# Altium schematic sheet Power.SchDoc
size A4; SheetNumber: 3; SheetTotal: 3
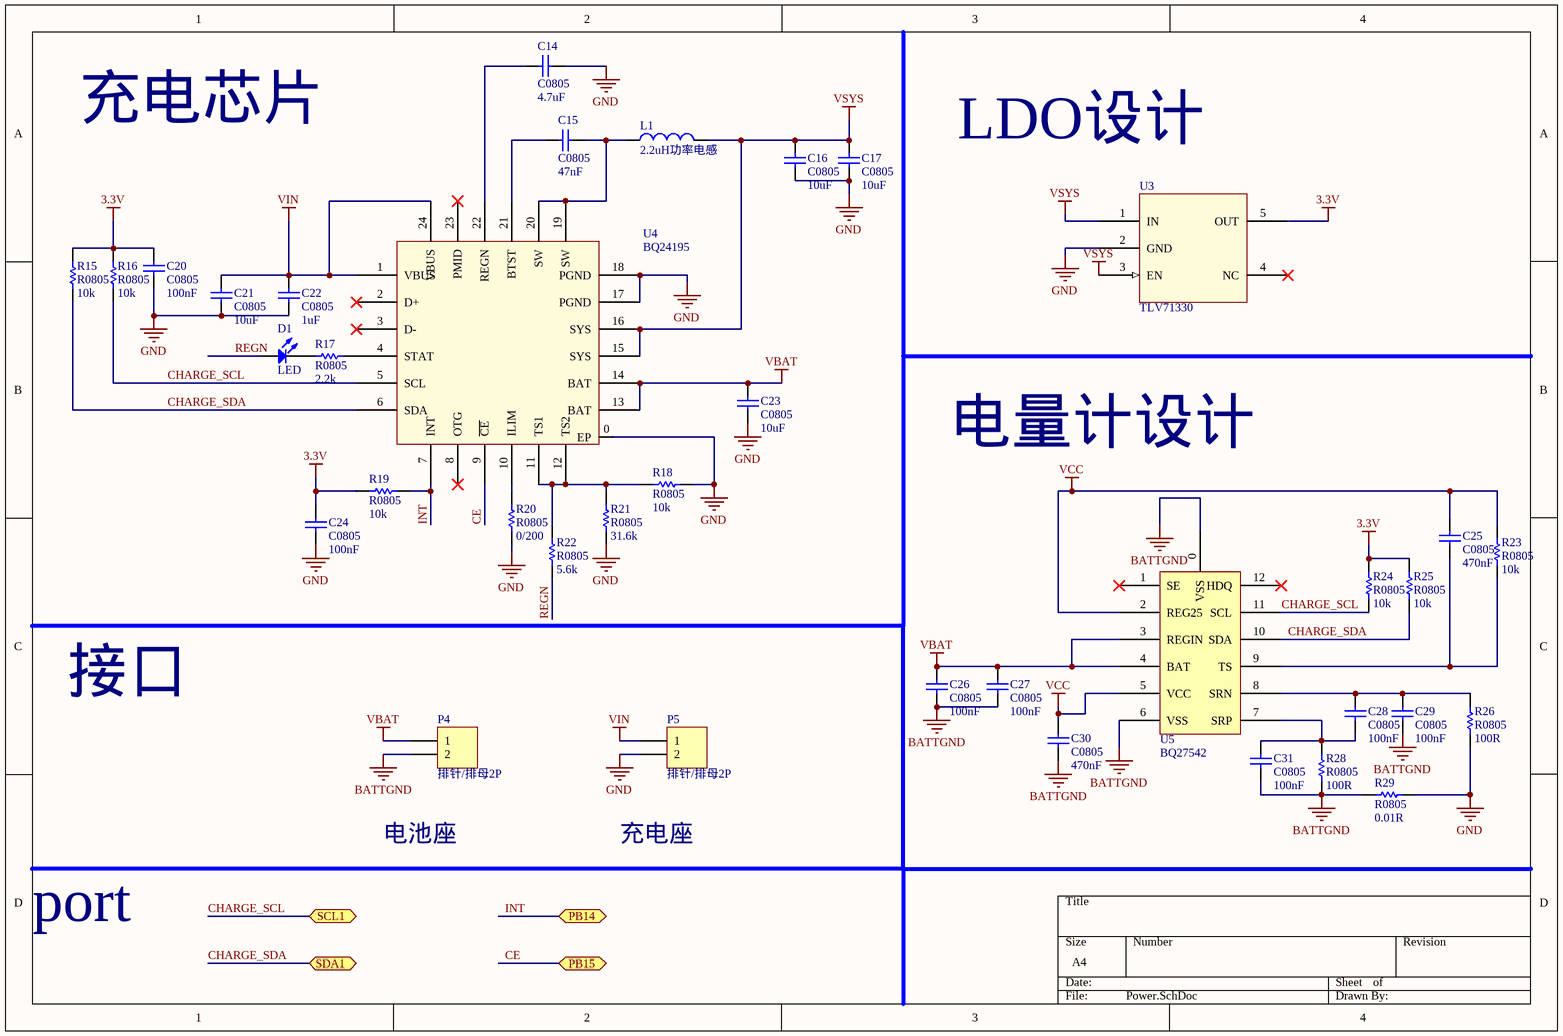
[diagram p0: Power.SchDoc]

## Parts
C14  Case/Package: C0805  [C0805_200X125X140L50N]  (hidden comment: 4.7uF)
C15  Case/Package: C0805  [C0805_200X125X140L50N]  (hidden comment: 47nF)
C16  Case/Package: C0805  [C0805_200X125X140L50N]  (hidden comment: 10uF)
C17  Case/Package: C0805  [C0805_200X125X140L50N]  (hidden comment: 10uF)
C20  Case/Package: C0805  [C0805_200X125X140L50N]  (hidden comment: 100nF)
C21  Case/Package: C0805  [C0805_200X125X140L50N]  (hidden comment: 10uF)
C22  Case/Package: C0805  [C0805_200X125X140L50N]  (hidden comment: 1uF)
C23  Case/Package: C0805  [C0805_200X125X140L50N]  (hidden comment: 10uF)
C24  Case/Package: C0805  [C0805_200X125X140L50N]  (hidden comment: 100nF)
C25  Case/Package: C0805  [C0805_200X125X140L50N]  (hidden comment: 470nF)
C26  Case/Package: C0805  [C0805_200X125X140L50N]  (hidden comment: 100nF)
C27  Case/Package: C0805  [C0805_200X125X140L50N]  (hidden comment: 100nF)
C28  Case/Package: C0805  [C0805_200X125X140L50N]  (hidden comment: 100nF)
C29  Case/Package: C0805  [C0805_200X125X140L50N]  (hidden comment: 100nF)
C30  Case/Package: C0805  [C0805_200X125X140L50N]  (hidden comment: 470nF)
C31  Case/Package: C0805  [C0805_200X125X140L50N]  (hidden comment: 100nF)
D1  LED  [LED0805]
L1  2.2uH功率电感4NR4018T2R2M  [4018]  (value not drawn)
P4  排针/排母2P  [HDR1X2]
P5  排针/排母2P  [HDR1X2]
R15  Case/Package: R0805  [R0805_200X125X140L50N]  (hidden comment: 10k)
R16  Case/Package: R0805  [R0805_200X125X140L50N]  (hidden comment: 10k)
R17  Case/Package: R0805  [R0805_200X125X140L50N]  (hidden comment: 2.2k)
R18  Case/Package: R0805  [R0805_200X125X140L50N]  (hidden comment: 10k)
R19  Case/Package: R0805  [R0805_200X125X140L50N]  (hidden comment: 10k)
R20  Case/Package: R0805  [R0805_200X125X140L50N]  (hidden comment: 0/200)
R21  Case/Package: R0805  [R0805_200X125X140L50N]  (hidden comment: 31.6k)
R22  Case/Package: R0805  [R0805_200X125X140L50N]  (hidden comment: 5.6k)
R23  Case/Package: R0805  [R0805_200X125X140L50N]  (hidden comment: 10k)
R24  Case/Package: R0805  [R0805_200X125X140L50N]  (hidden comment: 10k)
R25  Case/Package: R0805  [R0805_200X125X140L50N]  (hidden comment: 10k)
R26  Case/Package: R0805  [R0805_200X125X140L50N]  (hidden comment: 100R)
R28  Case/Package: R0805  [R0805_200X125X140L50N]  (hidden comment: 100R)
R29  Case/Package: R0805  [R0805_200X125X140L50N]  (hidden comment: 0.01R)
U3  TLV71330  [SOT-23-5]
U4  BQ24195  [BQ24195 PVQFN42]
U5  BQ27542  [BQ27542-G1]

## Ports
PB14 (bidir), PB15 (bidir), SCL1 (bidir), SDA1 (bidir)

## Nets
3.3V: C20.2 C24.2 R15.2 R16.2 R19.2 R24.2 R25.2 U3.5(OUT)
BATTGND: C26.1 C27.1 C29.1 C30.1 C31.1 P4.2 R28.1 R29.2 U5.0(VSS) U5.6(VSS)
GND: C14.1 C16.1 C17.1 C20.1 C21.1 C22.1 C23.1 C24.1 P5.2 R18.2 R20.2 R21.2 R26.1 R29.1 U3.2(GND) U4.0(EP) U4.17(PGND) U4.18(PGND)
VBAT: C23.2 C26.2 C27.2 P4.1 U4.13(BAT) U4.14(BAT) U5.3(REGIN) U5.4(BAT)
VCC: C25.2 C30.2 R23.2 U5.2(REG25) U5.5(VCC)
VIN: C21.2 C22.2 P5.1 U4.1(VBUS) U4.24(VBUS)
VSYS: C16.2 C17.2 L1.2 U3.1(IN) U3.3(EN) U4.15(SYS) U4.16(SYS)
CE: U4.9(~{CE}) ; port PB15
CHARGE_SCL: R16.1 R24.1 U4.5(SCL) U5.11(SCL) ; port SCL1
CHARGE_SDA: R15.1 R25.1 U4.6(SDA) U5.10(SDA) ; port SDA1
INT: R19.1 U4.7(INT) ; port PB14
REGN: D1.1(A) R22.2
NetC14_2: C14.2 U4.22(REGN)
NetC15_1: C15.1 L1.1 U4.19(SW) U4.20(SW)
NetC15_2: C15.2 U4.21(BTST)
NetC25_1: C25.1 R23.1 U5.9(TS)
NetC28_1: C28.1 C31.2 R28.2 U5.7(SRP)
NetC28_2: C28.2 C29.2 R26.2 U5.8(SRN)
NetD1_2: D1.2(K) R17.1
NetR17_2: R17.2 U4.4(STAT)
NetR18_1: R18.1 R21.1 R22.1 U4.11(TS1) U4.12(TS2)
NetR20_1: R20.1 U4.10(ILIM)

Not connected (* = marked no-connect by the designer): U3 4(NC)*; U4 2(D+)* 3(D-)* 8(OTG)* 23(PMID)*; U5 1(SE)* 12(HDQ)*

## Notes on the sheet
- 充电芯片
- LDO设计
- 电量计设计
- 接口
- 电池座
- 充电座
- port
- (in symbol L) 2.2uH功率电感

## Library data of the parts
C14-C17 C20-C31 = Cap0805: 0805 SMT MLCC Capacitor; Voltage: 50V; Tolerance: 10%; ProductIndex: 11; Published: 8-Jun-2000; LatestRevisionDate: 17-Jul-2002; LatestRevisionNote: Re-released for DXP Platform.; PackageReference: RAD-0.3; Publisher: Altium Limited; PackageDescription: Radial Cap, Thru-Hole; 2 Leads; 0.3 in Pin Spacing; Voltage Rating: 50V; ProductType: Capacitors
  C14: Value: 4.7uF
  C15: Value: 47nF
  C16 C17 C21 C23: Value: 10uF
  C20 C24 C26-C29 C31: Value: 100nF
  C22: Value: 1uF
  C25 C30: Value: 470nF
D1 = LED: Typical RED, GREEN, YELLOW, AMBER GaAs LED; Published: 8-Jun-2000; LatestRevisionDate: 17-Jul-2002; LatestRevisionNote: Re-released for DXP Platform.; PackageDocument: Feb-2002; PackageReference: 3.2X1.6X1.1; Publisher: Altium Limited; UnitPrice: 0.05
L1 = L: 电感; 创建: 高鹏20160422
P4 P5 = Header 2: Header, 2-Pin; LatestRevisionDate: 17-Jul-2002; LatestRevisionNote: Re-released for DXP Platform.; Publisher: Altium Limited
R15-R26 R28 R29 = Res0805: 0805 SMT Resistor; Tolerance: 1%; ProductIndex: 10; Published: 8-Jun-2000; LatestRevisionDate: 17-Jul-2002; LatestRevisionNote: Re-released for DXP Platform.; PackageReference: AXIAL-0.3; Publisher: Altium Limited; PackageDescription: Axial Device, Thru-Hole; 2 Leads; 0.3 in Pin Spacing; ProductType: Resistors
  R15 R16 R18 R19 R23-R25: Value: 10k
  R17: Value: 2.2k
  R20: Value: 0/200
  R21: Value: 31.6k
  R22: Value: 5.6k
  R26 R28: Value: 100R
  R29: Value: 0.01R
U3 = TLV71330: TLV713 Capacitor-Free, 150-mA, Low-Dropout Regulator / With Foldback Current Limit for Portable Devices; Manufacturer: Analog Devices; ProductIndex: 0; ProductType: Integrated Circuits; Case/Package: SOT-23; Value: TLV71330
U4 = BQ24195: bq2419x I / 2C Controlled 4.5-A Single Cell USB/Adapter Charger / with Narrow VDC Power Path Management and USB OTG; Manufacturer: TI; ProductIndex: 0; ProductType: Integrated Circuits; Case/Package: QFN24; ComponentLink1Description: Datasheet; ComponentLink1URL: https://www.ti.com/lit/ds/symlink/bq24195.pdf; Value: BQ24195
U5 = BQ27542: Single Cell Li-Ion Battery Fuel Gauge for Battery Pack Integration; Manufacturer: TI; ProductIndex: Integrated Circuits; ProductType: 0; Case/Package: 非常见封装 FON?; ComponentLink1Description: Datasheet; ComponentLink1URL: https://www.ti.com/lit/ds/symlink/bq27541-v200.pdf; Value: BQ27542